# EAGLE design Backplane (EAGLE 6.6.0)
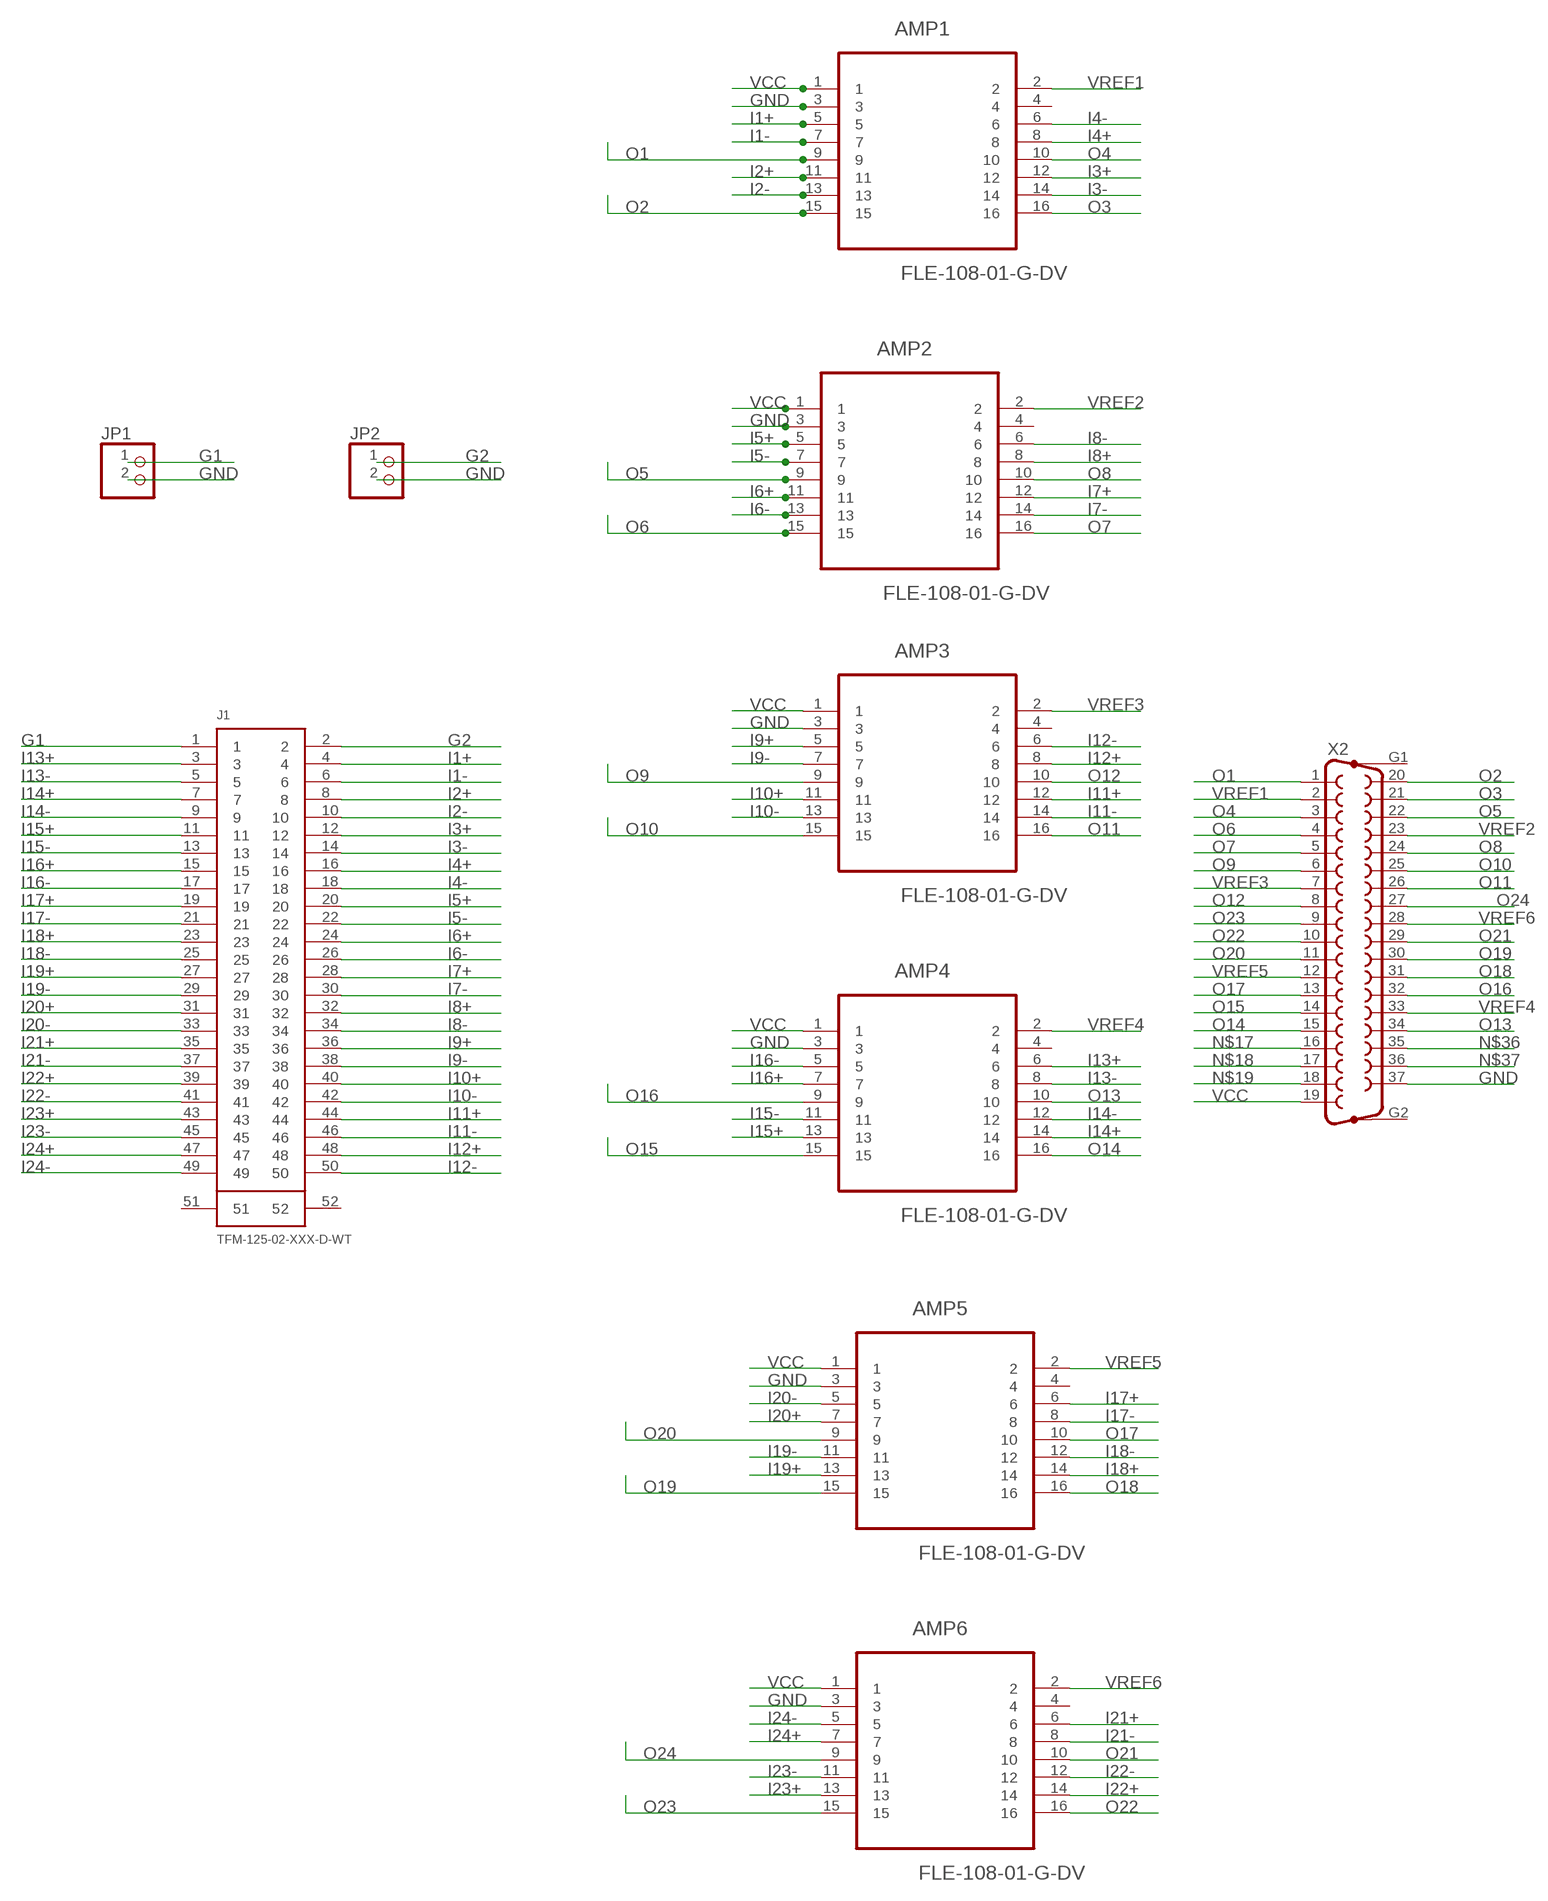
[diagram p0: schematic, sheet 1]

## Parts
AMP1  FLE-108-01-G-DV  [SAMTEC_FLE-108-01-G-DV]
AMP2  FLE-108-01-G-DV  [SAMTEC_FLE-108-01-G-DV]
AMP3  FLE-108-01-G-DV  [SAMTEC_FLE-108-01-G-DV]
AMP4  FLE-108-01-G-DV  [SAMTEC_FLE-108-01-G-DV]
AMP5  FLE-108-01-G-DV  [SAMTEC_FLE-108-01-G-DV]
AMP6  FLE-108-01-G-DV  [SAMTEC_FLE-108-01-G-DV]
J1  TFM-125-02-XXX-D-WT  [TFM-125-02-XXX-D-WT]
JP1  PINHD-1X2  [1X02]
JP2  PINHD-1X2  [1X02]
X2  F37HP  [F37HP]

## Nets
G1: J1.1 JP1.1
G2: J1.2 JP2.1
GND: AMP1.3 AMP2.3 AMP3.3 AMP4.3 AMP5.3 AMP6.3 JP1.2 JP2.2 X2.37
I1+: AMP1.5 J1.4
I1-: AMP1.7 J1.6
I2+: AMP1.11 J1.8
I2-: AMP1.13 J1.10
I3+: AMP1.12 J1.12
I3-: AMP1.14 J1.14
I4+: AMP1.8 J1.16
I4-: AMP1.6 J1.18
I5+: AMP2.5 J1.20
I5-: AMP2.7 J1.22
I6+: AMP2.11 J1.24
I6-: AMP2.13 J1.26
I7+: AMP2.12 J1.28
I7-: AMP2.14 J1.30
I8+: AMP2.8 J1.32
I8-: AMP2.6 J1.34
I9+: AMP3.5 J1.36
I9-: AMP3.7 J1.38
I10+: AMP3.11 J1.40
I10-: AMP3.13 J1.42
I11+: AMP3.12 J1.44
I11-: AMP3.14 J1.46
I12+: AMP3.8 J1.48
I12-: AMP3.6 J1.50
I13+: AMP4.6 J1.3
I13-: AMP4.8 J1.5
I14+: AMP4.14 J1.7
I14-: AMP4.12 J1.9
I15+: AMP4.13 J1.11
I15-: AMP4.11 J1.13
I16+: AMP4.7 J1.15
I16-: AMP4.5 J1.17
I17+: AMP5.6 J1.19
I17-: AMP5.8 J1.21
I18+: AMP5.14 J1.23
I18-: AMP5.12 J1.25
I19+: AMP5.13 J1.27
I19-: AMP5.11 J1.29
I20+: AMP5.7 J1.31
I20-: AMP5.5 J1.33
I21+: AMP6.6 J1.35
I21-: AMP6.8 J1.37
I22+: AMP6.14 J1.39
I22-: AMP6.12 J1.41
I23+: AMP6.13 J1.43
I23-: AMP6.11 J1.45
I24+: AMP6.7 J1.47
I24-: AMP6.5 J1.49
N$17: X2.16
N$18: X2.17
N$19: X2.18
N$36: X2.35
N$37: X2.36
O1: AMP1.9 X2.1
O2: AMP1.15 X2.20
O3: AMP1.16 X2.21
O4: AMP1.10 X2.3
O5: AMP2.9 X2.22
O6: AMP2.15 X2.4
O7: AMP2.16 X2.5
O8: AMP2.10 X2.24
O9: AMP3.9 X2.6
O10: AMP3.15 X2.25
O11: AMP3.16 X2.26
O12: AMP3.10 X2.8
O13: AMP4.10 X2.34
O14: AMP4.16 X2.15
O15: AMP4.15 X2.14
O16: AMP4.9 X2.32
O17: AMP5.10 X2.13
O18: AMP5.16 X2.31
O19: AMP5.15 X2.30
O20: AMP5.9 X2.11
O21: AMP6.10 X2.29
O22: AMP6.16 X2.10
O23: AMP6.15 X2.9
O24: AMP6.9 X2.27
VCC: AMP1.1 AMP2.1 AMP3.1 AMP4.1 AMP5.1 AMP6.1 X2.19
VREF1: AMP1.2 X2.2
VREF2: AMP2.2 X2.23
VREF3: AMP3.2 X2.7
VREF4: AMP4.2 X2.33
VREF5: AMP5.2 X2.12
VREF6: AMP6.2 X2.28
Unconnected: AMP1.4 AMP2.4 AMP3.4 AMP4.4 AMP5.4 AMP6.4 J1.51 J1.52 X2.G1 X2.G2

## Library data of the parts
AMP1-AMP6 = SAMTEC-FLE-Mxx-Sxx_By_element14_Batch_1:FLE-108-01-G-DV: CONN SOCKET, 1.27MM, SMT, 16WAY; MPN: FLE-108-01-G-DV; OC_FARNELL: 1929625; OC_NEWARK: 26K2845; PACKAGE: SOCKET, 1.27MM, SMT, 16WAY; SUPPLIER: SAMTEC
J1 = TFM-125-02-XXX-D-WT:TFM-125-02-XXX-D-WT: 0.050"X0.050" SURFACE MOUNT TERMINAL STRIP WITH DUAL WELD TAB.
JP1 JP2 = pinhead:PINHD-1X2: PIN HEADER
X2 = con-subd:F37HP: SUB-D; OC_FARNELL: unknown; OC_NEWARK: unknown

## Board
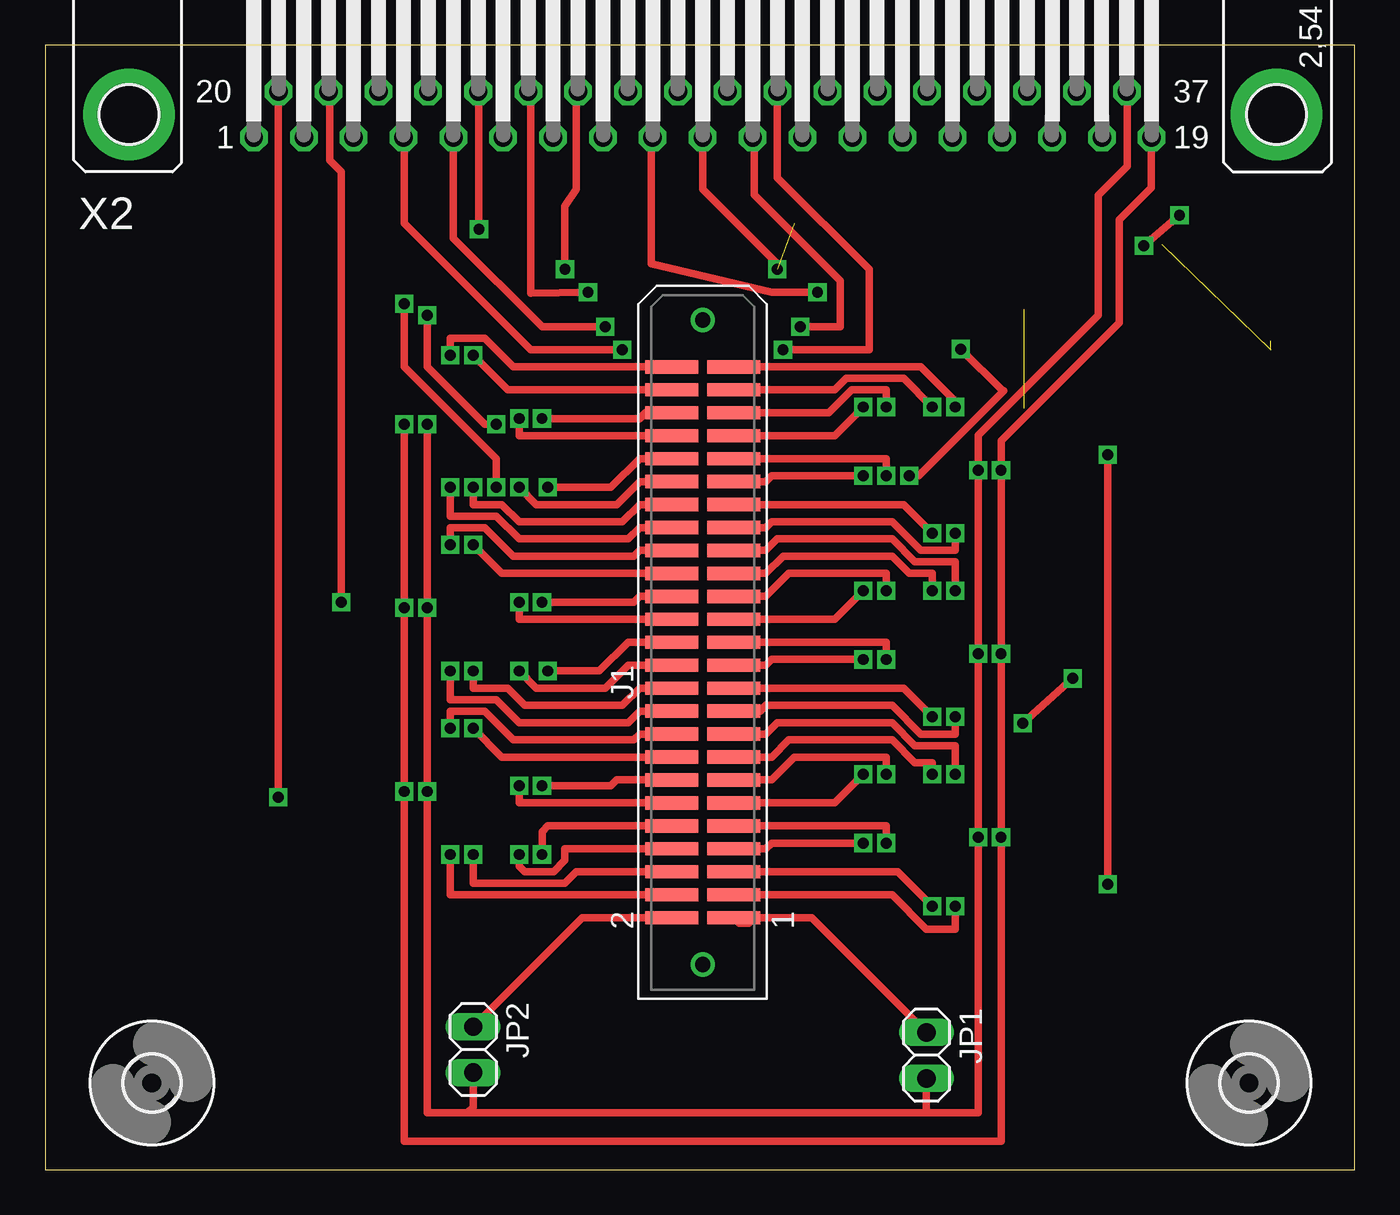
[diagram p1: board, top side]
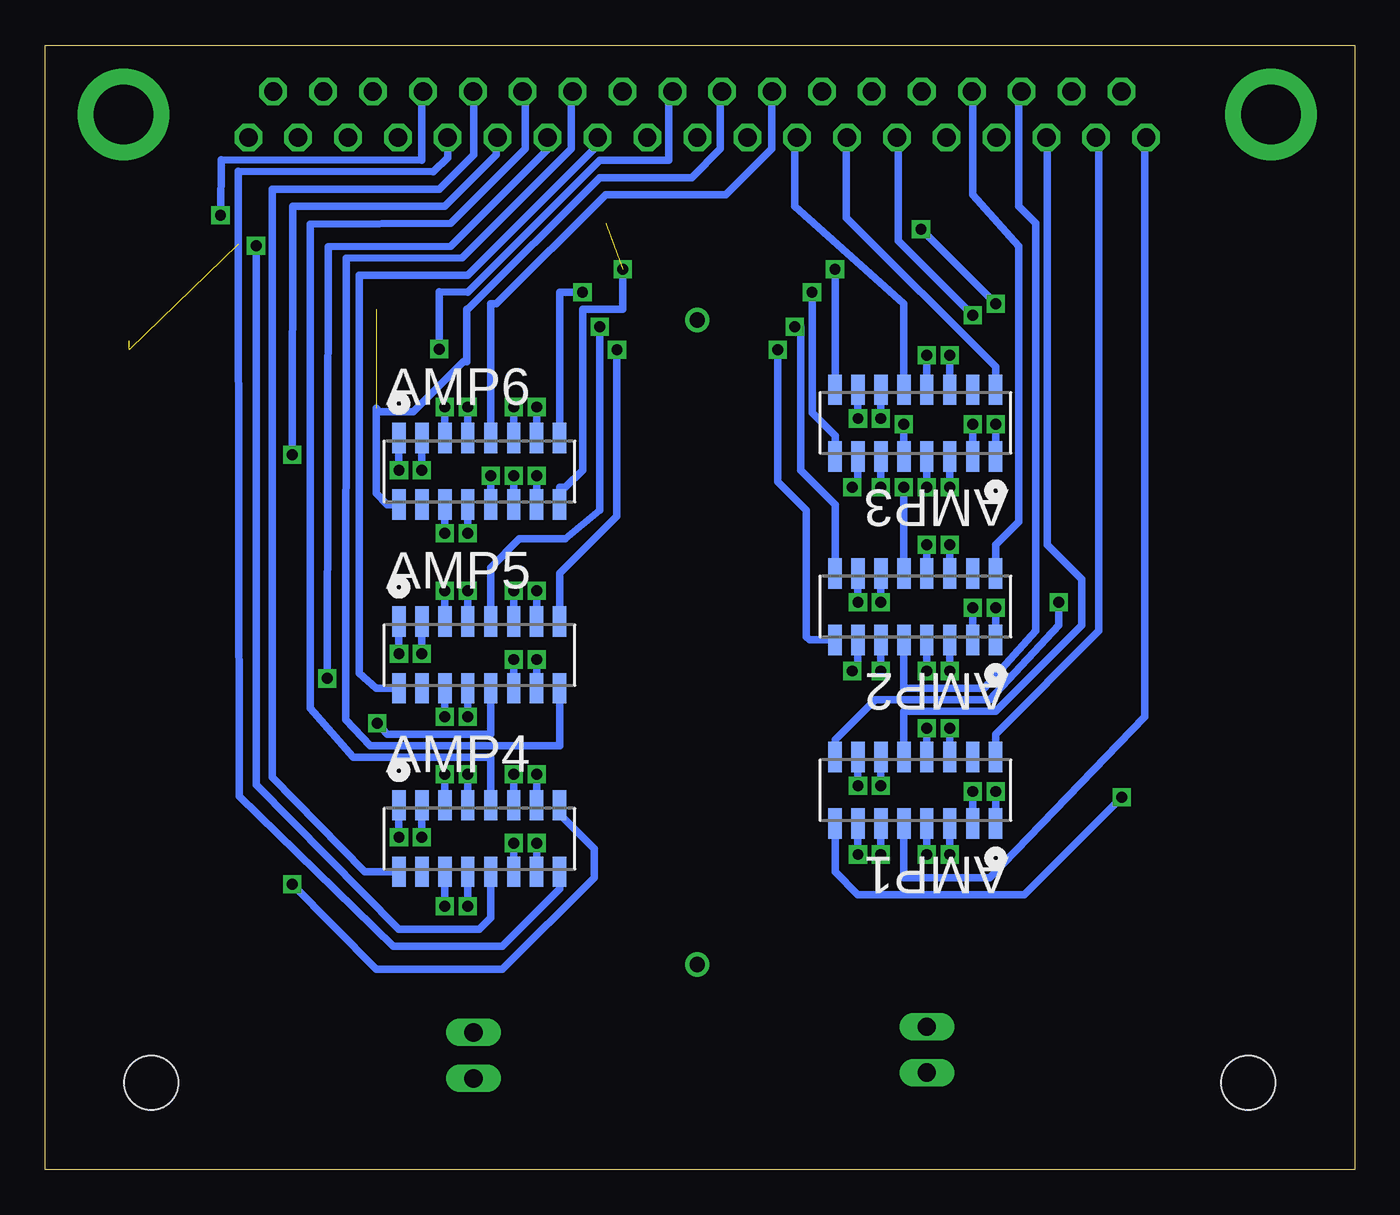
[diagram p2: board, bottom side, seen from below]

Size 72.47 x 62.22 mm. Coordinates in mm from the lower left corner, seen from the top.
Outline: 0,0 72.47,0 72.47,62.22 0,62.22 0,0
Copper layers (1*16): Top 0.035mm / dielectric 1.5mm / Bottom 0.035mm
Design rules "default *": minimum track width 10mil, minimum drill 10mil, track to track 8mil, track to pad 8mil, pad to pad 8mil, via to via 8mil, smd to smd 8mil, copper to edge 40mil, drill to drill 8mil, minimum pad ring 10mil, minimum via ring 8mil, stop-mask expansion 4mil, vias tented up to drill 0mil, thermal gap 10mil

### Footprints (pad centres in the part's own frame; a part is rotated, then mirrored left to right if it is on the bottom)
SAMTEC_FLE-108-01-G-DV = smd 0.737 x 1.676: 1 -8.89,3.683; 2 -8.89,0; 3 -7.62,3.683; 4 -7.62,0; 5 -6.35,3.683; 6 -6.35,0; 7 -5.08,3.683; 8 -5.08,0; 9 -3.81,3.683; 10 -3.81,0; 11 -2.54,3.683; 12 -2.54,0; 13 -1.27,3.683; 14 -1.27,0; 15 0,3.683; 16 0,0
TFM-125-02-XXX-D-WT = smd 0.737 x 2.921: 1 -15.24,-1.714; 2 -15.24,1.714; 3 -13.97,-1.714; 4 -13.97,1.714; 5 -12.7,-1.714; 6 -12.7,1.714; 7 -11.43,-1.714; 8 -11.43,1.714; 9 -10.16,-1.714; 10 -10.16,1.714; 11 -8.89,-1.714; 12 -8.89,1.714; 13 -7.62,-1.714; 14 -7.62,1.714; 15 -6.35,-1.714; 16 -6.35,1.714; 17 -5.08,-1.714; 18 -5.08,1.714; 19 -3.81,-1.714; 20 -3.81,1.714; 21 -2.54,-1.714; 22 -2.54,1.714; 23 -1.27,-1.714; 24 -1.27,1.714; 25 0,-1.714; 26 0,1.714; 27 1.27,-1.714; 28 1.27,1.714; 29 2.54,-1.714; 30 2.54,1.714; 31 3.81,-1.714; 32 3.81,1.714; 33 5.08,-1.714; 34 5.08,1.714; 35 6.35,-1.714; 36 6.35,1.714; 37 7.62,-1.714; 38 7.62,1.714; 39 8.89,-1.714; 40 8.89,1.714; 41 10.16,-1.714; 42 10.16,1.714; 43 11.43,-1.714; 44 11.43,1.714; 45 12.7,-1.714; 46 12.7,1.714; 47 13.97,-1.714; 48 13.97,1.714; 49 15.24,-1.714; 50 15.24,1.714 | drill 0.838: 51 -17.831,0; 52 17.831,0
1X02 = drill 1.016 long: 1 -1.27,0; 2 1.27,0
3,0 = hole 3: 0,0
F37HP = drill 1.016 octagon: 1 -24.841,-1.27; 2 -22.073,-1.27; 3 -19.329,-1.27; 4 -16.561,-1.27; 5 -13.792,-1.27; 6 -11.049,-1.27; 7 -8.28,-1.27; 8 -5.512,-1.27; 9 -2.769,-1.27; 10 0,-1.27; 11 2.769,-1.27; 12 5.512,-1.27; 13 8.28,-1.27; 14 11.049,-1.27; 15 13.818,-1.27; 16 16.561,-1.27; 17 19.329,-1.27; 18 22.098,-1.27; 19 24.841,-1.27; 20 -23.47,1.27; 21 -20.701,1.27; 22 -17.932,1.27; 23 -15.189,1.27; 24 -12.421,1.27; 25 -9.652,1.27; 26 -6.909,1.27; 27 -4.14,1.27; 28 -1.372,1.27; 29 1.372,1.27; 30 4.14,1.27; 31 6.909,1.27; 32 9.677,1.27; 33 12.421,1.27; 34 15.189,1.27; 35 17.958,1.27; 36 20.701,1.27; 37 23.47,1.27 | drill 3.302 pad 5.08: G1 -31.75,0; G2 31.75,0

### Placement (x,y rotation side)
AMP1  28.77,22.83 180 bottom
AMP2  28.77,32.99 180 bottom
AMP3  28.77,43.15 180 bottom
AMP4  44.01,16.48 0 bottom
AMP5  44.01,26.64 0 bottom
AMP6  44.01,36.8 0 bottom
J1  36.39,29.18 90 top
JP1  48.77,6.32 270 top
JP2  23.69,6.64 270 top
U$1  [3,0]  66.61,4.79 0 top
U$2  [3,0]  5.91,4.79 0 top
X2  36.39,58.39 0 top

### Tracks (layer width: path | path; a pad name or v marks a point on that pad's centre or on a via)
G1
  Top 0.406: JP1.1 42.42,13.94 39.24,13.94 38.93,13.62 38.42,13.62 J1.1
G2
  Top 0.406: J1.2 29.72,13.94 JP2.1
GND  (via drill 0.6)
  Top 0.406: 48.77,3.14 51.63,3.14 v51.63,18.38 v51.63,28.54 v51.63,38.7 51.63,40.64 58.26,47.28 58.26,53.91 59.88,55.53 59.88,59.63 X2.37 | 48.77,3.14 23.37,3.14 | 23.37,3.14 21.15,3.14 v21.15,20.92 v21.15,31.08 v21.15,41.24 | JP2.2 23.69,3.46 23.37,3.14 | JP1.2 48.77,3.14
  Bottom 0.406: v51.63,38.7 AMP6.3 | v51.63,28.54 AMP5.3 | v51.63,18.38 AMP4.3 | v21.15,20.92 AMP1.3 | AMP3.3 v21.15,41.24 | AMP2.3 v21.15,31.08
I1+  (via drill 0.6)
  Top 0.406: v22.42,17.43 22.42,15.21 J1.4
  Bottom 0.406: AMP1.5 v22.42,17.43
I1-  (via drill 0.6)
  Top 0.406: v23.69,17.43 23.69,15.84 28.77,15.84 29.4,16.48 J1.6
  Bottom 0.406: AMP1.7 v23.69,17.43
I2+  (via drill 0.6)
  Top 0.406: v26.23,17.43 26.23,16.8 26.54,16.48 28.13,16.48 28.77,17.11 28.77,17.75 J1.8
  Bottom 0.406: AMP1.11 v26.23,17.43
I2-  (via drill 0.6)
  Top 0.406: v27.5,17.43 27.5,18.7 27.81,19.02 J1.10
  Bottom 0.406: AMP1.13 v27.5,17.43
I3+  (via drill 0.6)
  Top 0.406: J1.12 26.23,20.29 v26.23,21.24
  Bottom 0.406: v26.23,21.24 AMP1.12
I3-  (via drill 0.6)
  Top 0.406: J1.14 31.62,21.56 31.31,21.24 v27.5,21.24
  Bottom 0.406: v27.5,21.24 AMP1.14
I4+  (via drill 0.6)
  Top 0.406: J1.16 25.27,22.83 v23.69,24.42
  Bottom 0.406: v23.69,24.42 AMP1.8
I4-  (via drill 0.6)
  Top 0.406: v22.42,24.42 22.42,25.37 24.32,25.37 25.91,23.78 32.58,23.78 32.89,24.1 J1.18
  Bottom 0.406: v22.42,24.42 AMP1.6
I5+  (via drill 0.6)
  Top 0.406: v22.42,27.59 22.42,26 24.96,26 26.23,24.73 32.26,24.73 32.89,25.37 J1.20
  Bottom 0.406: v22.42,27.59 AMP2.5
I5-  (via drill 0.6)
  Top 0.406: v23.69,27.59 23.69,26.64 25.59,26.64 26.54,25.69 31.94,25.69 32.89,26.64 J1.22
  Bottom 0.406: v23.69,27.59 AMP2.7
I6+  (via drill 0.6)
  Top 0.406: J1.24 32.26,27.91 30.99,26.64 27.18,26.64 v26.23,27.59
  Bottom 0.406: v26.23,27.59 AMP2.11
I6-  (via drill 0.6)
  Top 0.406: J1.26 32.26,29.18 30.67,27.59 v27.81,27.59
  Bottom 0.406: v27.81,27.59 27.5,27.91 AMP2.13
I7+  (via drill 0.6)
  Top 0.406: J1.28 26.23,30.45 v26.23,31.4
  Bottom 0.406: v26.23,31.4 AMP2.12
I7-  (via drill 0.6)
  Top 0.406: J1.30 32.89,31.72 32.58,31.4 v27.5,31.4
  Bottom 0.406: v27.5,31.4 AMP2.14
I8+  (via drill 0.6)
  Top 0.406: J1.32 25.27,32.99 v23.69,34.58
  Bottom 0.406: v23.69,34.58 AMP2.8
I8-  (via drill 0.6)
  Top 0.406: J1.34 32.89,34.26 32.58,33.94 25.91,33.94 24.32,35.53 22.42,35.53 v22.42,34.58
  Bottom 0.406: v22.42,34.58 AMP2.6
I9+  (via drill 0.6)
  Top 0.406: J1.36 32.89,35.53 32.26,34.89 26.23,34.89 24.96,36.16 22.42,36.16 v22.42,37.75
  Bottom 0.406: v22.42,37.75 AMP3.5
I9-  (via drill 0.6)
  Top 0.406: J1.38 32.89,36.8 31.94,35.85 26.23,35.85 25.27,36.8 23.69,36.8 v23.69,37.75
  Bottom 0.406: v23.69,37.75 AMP3.7
I10+  (via drill 0.6)
  Top 0.406: J1.40 32.89,38.07 31.62,36.8 27.18,36.8 v26.23,37.75
  Bottom 0.406: v26.23,37.75 AMP3.11
I10-  (via drill 0.6)
  Top 0.406: J1.42 32.89,39.34 31.31,37.75 v27.81,37.75
  Bottom 0.406: v27.81,37.75 27.5,38.07 AMP3.13
I11+  (via drill 0.6)
  Top 0.406: J1.44 26.23,40.61 v26.23,41.56
  Bottom 0.406: v26.23,41.56 AMP3.12
I11-  (via drill 0.6)
  Top 0.406: J1.46 33.21,41.88 32.89,41.56 v27.5,41.56
  Bottom 0.406: v27.5,41.56 AMP3.14
I12+  (via drill 0.6)
  Top 0.406: J1.48 25.59,43.15 v23.69,45.05
  Bottom 0.406: v23.69,45.05 AMP3.8
I12-  (via drill 0.6)
  Top 0.406: J1.50 25.91,44.42 24.32,46.01 22.42,46.01 v22.42,45.05
  Bottom 0.406: v22.42,45.05 AMP3.6
I13+  (via drill 0.6)
  Top 0.406: J1.3 46.86,15.21 48.77,13.3 50.36,13.3 v50.36,14.57
  Bottom 0.406: v50.36,14.57 AMP4.6
I13-  (via drill 0.6)
  Top 0.406: J1.5 47.18,16.48 v49.09,14.57
  Bottom 0.406: v49.09,14.57 AMP4.8
I14+  (via drill 0.6)
  Top 0.406: J1.7 39.88,17.75 40.2,18.07 v45.28,18.07
  Bottom 0.406: v45.28,18.07 AMP4.14
I14-  (via drill 0.6)
  Top 0.406: J1.9 46.55,19.02 v46.55,18.07
  Bottom 0.406: v46.55,18.07 AMP4.12
I15+  (via drill 0.6)
  Top 0.406: J1.11 43.69,20.29 v45.28,21.88
  Bottom 0.406: v45.28,21.88 AMP4.13
I15-  (via drill 0.6)
  Top 0.406: J1.13 40.2,21.56 41.47,22.83 46.55,22.83 v46.55,21.88
  Bottom 0.406: v46.55,21.88 AMP4.11
I16+  (via drill 0.6)
  Top 0.406: J1.15 40.2,22.83 41.15,23.78 46.86,23.78 48.13,22.51 49.09,22.51 v49.09,21.88
  Bottom 0.406: v49.09,21.88 AMP4.7
I16-  (via drill 0.6)
  Top 0.406: J1.17 39.88,24.1 40.51,24.73 46.86,24.73 48.13,23.46 50.36,23.46 v50.36,21.88
  Bottom 0.406: v50.36,21.88 AMP4.5
I17+  (via drill 0.6)
  Top 0.406: J1.19 39.56,25.37 39.88,25.69 46.86,25.69 48.45,24.1 50.36,24.1 v50.36,25.05
  Bottom 0.406: v50.36,25.05 AMP5.6
I17-  (via drill 0.6)
  Top 0.406: J1.21 47.5,26.64 v49.09,25.05
  Bottom 0.406: v49.09,25.05 AMP5.8
I18+  (via drill 0.6)
  Top 0.406: J1.23 39.88,27.91 40.2,28.23 v45.28,28.23
  Bottom 0.406: v45.28,28.23 AMP5.14
I18-  (via drill 0.6)
  Top 0.406: J1.25 46.55,29.18 v46.55,28.23
  Bottom 0.406: v46.55,28.23 AMP5.12
I19+  (via drill 0.6)
  Top 0.406: J1.27 43.69,30.45 v45.28,32.04
  Bottom 0.406: v45.28,32.04 AMP5.13
I19-  (via drill 0.6)
  Top 0.406: J1.29 39.88,31.72 41.15,32.99 46.55,32.99 v46.55,32.04
  Bottom 0.406: v46.55,32.04 AMP5.11
I20+  (via drill 0.6)
  Top 0.406: J1.31 39.88,32.99 40.83,33.94 46.86,33.94 47.82,32.99 49.09,32.99 v49.09,32.04
  Bottom 0.406: v49.09,32.04 AMP5.7
I20-  (via drill 0.6)
  Top 0.406: J1.33 39.88,34.26 40.51,34.89 46.86,34.89 48.13,33.62 50.36,33.62 v50.36,32.04
  Bottom 0.406: v50.36,32.04 AMP5.5
I21+  (via drill 0.6)
  Top 0.406: J1.35 39.88,35.53 40.2,35.85 46.86,35.85 48.45,34.26 50.36,34.26 v50.36,35.21
  Bottom 0.406: v50.36,35.21 AMP6.6
I21-  (via drill 0.6)
  Top 0.406: J1.37 47.5,36.8 v49.09,35.21
  Bottom 0.406: v49.09,35.21 AMP6.8
I22+  (via drill 0.6)
  Top 0.406: J1.39 39.88,38.07 40.2,38.39 v45.28,38.39
  Bottom 0.406: v45.28,38.39 AMP6.14
I22-  (via drill 0.6)
  Top 0.406: J1.41 46.55,39.34 v46.55,38.39
  Bottom 0.406: v46.55,38.39 AMP6.12
I23+  (via drill 0.6)
  Top 0.406: J1.43 43.69,40.61 v45.28,42.2
  Bottom 0.406: v45.28,42.2 AMP6.13
I23-  (via drill 0.6)
  Top 0.406: J1.45 43.37,41.88 44.64,43.15 46.55,43.15 v46.55,42.2
  Bottom 0.406: v46.55,42.2 AMP6.11
I24+  (via drill 0.6)
  Top 0.406: J1.47 43.69,43.15 44.32,43.78 47.5,43.78 v49.09,42.2
  Bottom 0.406: v49.09,42.2 AMP6.7
I24-  (via drill 0.6)
  Top 0.406: J1.49 48.45,44.42 50.36,42.51 v50.36,42.2
  Bottom 0.406: v50.36,42.2 AMP6.5
O1
  Bottom 0.406: AMP1.9 24.96,16.16 20.19,16.16 11.62,25.05 11.62,57.04 X2.1
O2  (via drill 0.6)
  Top 0.406: v12.89,20.61 12.89,59.63 X2.20
  Bottom 0.406: AMP1.15 28.77,16.48 27.5,15.21 18.29,15.21 v12.89,20.61
O3  (via drill 0.6)
  Top 0.406: v16.38,31.4 16.38,55.21 15.75,55.85 15.75,59.59 X2.21
  Bottom 0.406: AMP1.16 28.77,23.78 26.54,26 20.19,26 16.38,30.13 v16.38,31.4
O4
  Bottom 0.406: AMP1.10 24.96,25.37 19.88,25.37 15.11,30.13 15.11,32.67 17.02,34.58 17.02,57.08 X2.3
O5
  Bottom 0.406: AMP2.9 24.96,26.64 20.51,26.64 17.65,29.81 17.65,52.36 18.61,53.31 18.61,59.51 X2.22
O6  (via drill 0.6)
  Top 0.406: v31.94,45.37 26.86,45.37 19.88,52.36 19.88,57.07 X2.4
  Bottom 0.406: AMP2.15 30.16,29.31 30.35,29.5 30.35,36.48 31.94,38.07 v31.94,45.37
O7  (via drill 0.6)
  Top 0.406: X2.5 22.59,51.54 27.5,46.64 v30.99,46.64
  Bottom 0.406: v30.99,46.64 30.67,46.64 30.67,38.7 28.77,36.8 AMP2.16
O8  (via drill 0.6)
  Top 0.406: v24.96,37.75 24.96,39.34 19.88,44.42 v19.88,47.91 | v24,52.04 24,59.62 X2.24
  Bottom 0.406: AMP2.10 v24.96,37.75 | v19.88,47.91 v24,52.04
O9  (via drill 0.6)
  Top 0.406: v24.96,41.24 24.32,41.24 21.15,44.42 v21.15,47.28 | 25.27,57.06 X2.6
  Bottom 0.406: AMP3.9 v24.96,41.24 | v21.15,47.28 25.27,51.4 25.27,57.06 X2.6
O10  (via drill 0.6)
  Top 0.406: v30.04,48.55 26.86,48.48 26.86,59.4 X2.25
  Bottom 0.406: AMP3.15 28.77,40.61 30.04,41.88 v30.04,48.55
O11  (via drill 0.6)
  Top 0.406: v28.77,49.82 28.77,53.31 29.4,54.26 29.4,59.58 X2.26
  Bottom 0.406: AMP3.16 v28.77,49.82
O12
  Bottom 0.406: AMP3.10 24.96,47.91 30.99,53.31 30.99,57 X2.8
O13  (via drill 0.6)
  Top 0.406: v60.8,51.12 v62.77,52.8
  Bottom 0.406: AMP4.10 47.82,13.94 48.45,13.3 52.9,13.3 60.8,21.3 v60.8,51.12 | v62.77,52.8 62.74,55.88 51.63,55.85 51.63,59.61 X2.34
O14  (2 unrouted)
  Bottom 0.406: AMP4.16 44.01,15.53 47.18,12.35 53.21,12.35 61.72,20.67 61.79,51.21 61.79,55.25 50.99,55.21 50.2,56 X2.15
O15  (via drill 0.6)
  Top 0.406: v58.8,15.78 v58.8,39.56
  Bottom 0.406: AMP4.15 44.01,19.65 42.1,17.75 42.1,16.16 47.18,11.08 54.17,11.08 v58.8,15.78 | X2.14 47.5,57.06 47.5,56.17 50.36,53.31 58.77,53.31 v58.8,39.56
O16
  Bottom 0.406: AMP4.9 47.82,22.83 55.44,22.83 57.82,25.53 57.82,52.32 50.04,52.36 45.91,56.48 45.91,59.51 X2.32
O17  (via drill 0.6)
  Top 0.406: v54.1,24.7 v56.86,27.18
  Bottom 0.406: AMP5.10 47.82,24.1 53.53,24.1 v54.1,24.7 | v56.86,27.18 56.8,51.05 50.04,51.09 44.67,56.46 X2.13
O18
  Bottom 0.406: AMP5.16 44.01,23.46 54.48,23.46 55.85,24.89 55.82,50.42 49.4,50.45 43.37,56.48 43.37,59.58 X2.31
O19  (via drill 0.6)
  Top 0.406: v40.83,45.37 45.59,45.37 45.59,49.82 40.51,54.9 40.51,59.65 X2.30
  Bottom 0.406: AMP5.15 44.01,32.99 40.83,36.16 v40.83,45.37
O20  (via drill 0.6)
  Top 0.406: v41.78,46.64 44.01,46.64 44.01,49.18 39.24,53.94 39.24,57.03 X2.11
  Bottom 0.406: AMP5.9 47.82,33.31 46.23,34.89 43.69,34.89 41.78,36.48 v41.78,46.64
O21  (via drill 0.6)
  Top 0.406: v47.82,38.39 48.36,38.39 53.05,43.09 52.99,43.09 v50.67,45.4
  Bottom 0.406: AMP6.10 v47.82,38.39 | X2.29 37.97,59.44 37.97,55.85 41.78,55.85 49.09,48.55 50.67,48.58 v50.67,45.4
O22  (via drill 0.6)  (1 unrouted)
  Top 0.406: v40.51,49.82 40.51,50.13 36.39,54.26 X2.10
  Bottom 0.406: AMP6.16 44.01,37.75 43.69,37.75 42.74,38.7 42.74,47.59 40.51,47.59 v40.51,49.82
O23  (via drill 0.6)
  Top 0.406: v42.74,48.55 40.2,48.55 33.53,50.13 33.53,57.03 X2.9
  Bottom 0.406: AMP6.15 44.01,48.55 v42.74,48.55
O24
  Bottom 0.406: AMP6.9 47.82,47.91 47.5,47.91 41.47,53.94 34.8,53.94 32.26,56.48 32.26,59.65 X2.27
VCC  (via drill 0.6)
  Top 0.406: v19.88,41.24 v19.88,31.08 v19.88,20.92 19.88,1.56 52.9,1.56 v52.9,18.38 v52.9,28.54 v52.9,38.7 52.9,40.32 59.44,46.86 59.44,52.55 61.21,54.32 61.21,57.11 X2.19
  Bottom 0.406: v52.9,38.7 AMP6.1 | v52.9,28.54 AMP5.1 | v52.9,18.38 AMP4.1 | v19.88,20.92 AMP1.1 | AMP3.1 v19.88,41.24 | AMP2.1 v19.88,31.08
VREF1
  Bottom 0.406: AMP1.2 19.88,24.1 14.16,29.81 14.16,56.97 X2.2
VREF2
  Bottom 0.406: AMP2.2 19.88,34.58 18.61,35.85 18.61,51.09 21.15,53.94 21.15,59.61 X2.23
VREF3
  Bottom 0.406: AMP3.2 19.88,44.42 28.13,52.67 28.13,57.09 X2.7
VREF4
  Bottom 0.406: AMP4.2 54.8,16.48 59.91,21.72 59.91,54.26 50.67,54.26 48.77,56.17 48.77,59.62 X2.33
VREF5
  Bottom 0.406: AMP5.2 54.17,26.64 55.09,27.46 55.09,49.5 49.09,49.5 41.78,56.8 41.78,57 X2.12
VREF6  (1 unrouted)
  Bottom 0.406: AMP6.2 53.53,36.8 54.17,37.43 54.17,42.13 53.98,41.94 52.1,41.94 49.34,44.7 49.15,44.7 49.15,47.59 49.09,47.59 41.78,54.9 36.7,54.9 35.12,56.48 35.12,59.56 X2.28